# Altium schematic sheet 24VRegulatorKhaled.SchDoc
size A
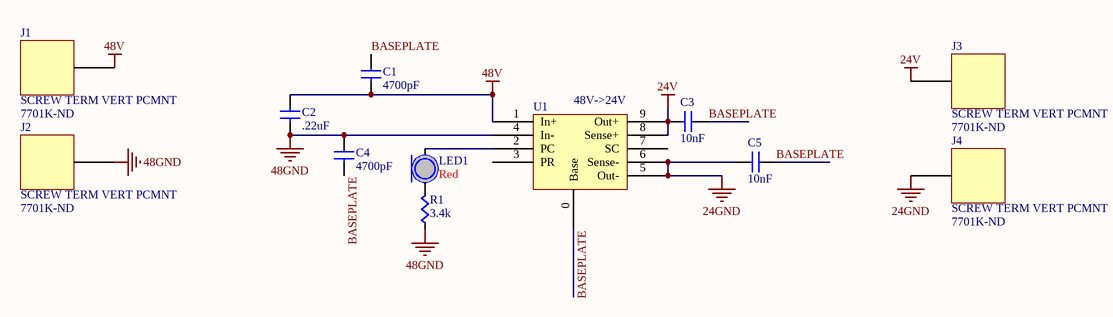
[diagram p0: 24VRegulatorKhaled.SchDoc]

## Parts
C1  value 4700pF  [Kemet PME271Y447MR30]  (hidden comment: Cap)
C2  value .22uF  [CAP2225]  (hidden comment: Cap)
C3  value 10nF  [CAP2225]  (hidden comment: Cap)
C4  value 4700pF  [Kemet PME271Y447MR30]  (hidden comment: Cap)
C5  value 10nF  [CAP2225]  (hidden comment: Cap)
J1  SCREW TERM VERT PCMNT  Supplier Part Number 1: 7701K-ND  [SCREW TERM SINGLE VERT]
J2  SCREW TERM VERT PCMNT  Supplier Part Number 1: 7701K-ND  [SCREW TERM SINGLE VERT]
J3  SCREW TERM VERT PCMNT  Supplier Part Number 1: 7701K-ND  [SCREW TERM SINGLE VERT]
J4  SCREW TERM VERT PCMNT  Supplier Part Number 1: 7701K-ND  [SCREW TERM SINGLE VERT]
LED1  Color: Red  [LED0603]  (hidden comment: LED)
R1  value 3.4k  [RES0603]  (hidden comment: Res)
U1  48V->24V  [FASTRAK_MINI_ONBOARD_MOUNT]

## Nets
24GND: C5.1(A) J4.0 U1.5(Out-) U1.6(Sense-)
24V: C3.1(A) J3.0 U1.8(Sense+) U1.9(Out+)
48GND: C2.2(B) C4.1(A) J2.0 R1.2(B) U1.4(In-)
48V: C1.2(B) C2.1(A) J1.0 U1.1(In+)
BASEPLATE: C1.1(A) C3.2(B) C4.2(B) C5.2(B) U1.0(Base)
NetLED1_A: LED1.A U1.2(PC)
NetLED1_C: LED1.C R1.1(A)

Not connected (* = marked no-connect by the designer): U1 3(PR) 7(SC)

## Library data of the parts
C1 C4 = Cap: Kemet PME271Y447MR30/P271HL472M250A; Supplier 1: Digi-Key; Supplier Part Number 1: 399-5411-ND
J1-J4 = SCREW TERM VERT PCMNT: Keystone Electronics 7701; Supplier 1: Digi-Key
U1 = V48B24C250BL: CONVERTER MOD DC/DC 24V 250W; Supplier 1: Digi-Key; Supplier Part Number 1: 1102-1414-ND
C2 C3 C5 = Cap: Supplier 1: Digi-Key
  C2: Supplier Part Number 1: 399-3460-1-ND
  C3 C5: Supplier Part Number 1: 399-7323-1-ND
LED1 = LED: Supplier 1: Digi-Key; Supplier Part Number 1: 754-1122-1-ND
R1 = Res: Supplier 1: Digi-Key; Supplier Part Number 1: RMCF0603FT3K40CT-ND